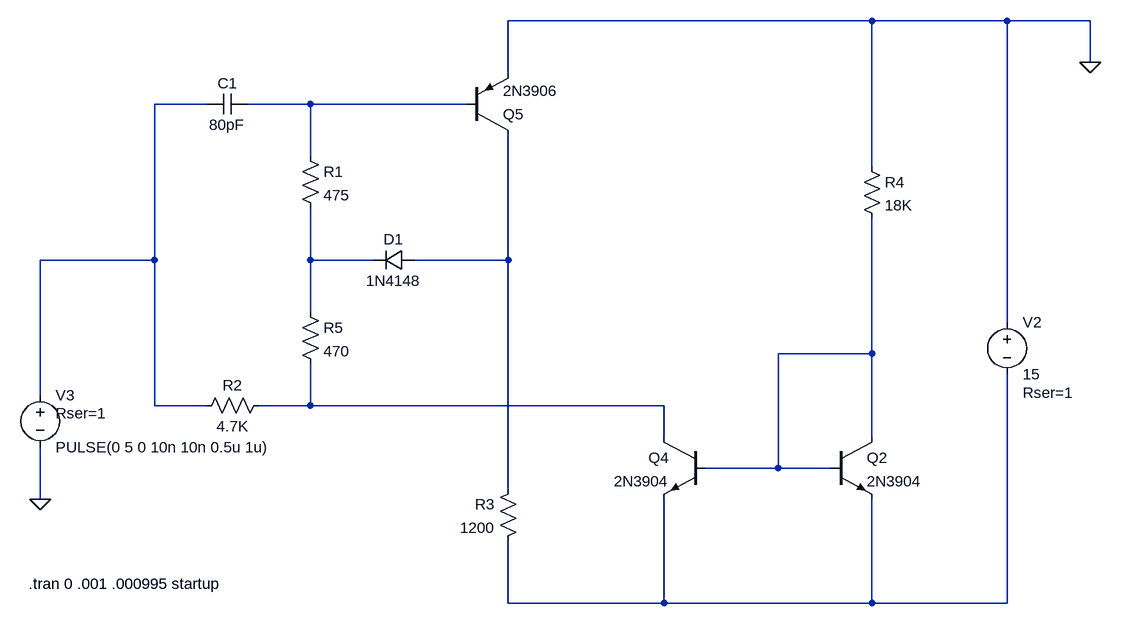
[diagram p0: schematic logicShift2.asc]
logicShift2.asc, the LTspice schematic file:
Version 4
SHEET 1 2612 788
WIRE 1968 -400 1408 -400
WIRE 2176 -400 1968 -400
WIRE 2304 -400 2176 -400
WIRE 2304 -336 2304 -400
WIRE 1408 -320 1408 -400
WIRE 944 -272 864 -272
WIRE 1104 -272 1008 -272
WIRE 1344 -272 1104 -272
WIRE 1104 -192 1104 -272
WIRE 1968 -176 1968 -400
WIRE 864 -32 864 -272
WIRE 864 -32 688 -32
WIRE 1104 -32 1104 -112
WIRE 1200 -32 1104 -32
WIRE 1408 -32 1408 -224
WIRE 1408 -32 1264 -32
WIRE 1104 48 1104 -32
WIRE 2176 64 2176 -400
WIRE 1968 112 1968 -96
WIRE 1968 112 1824 112
WIRE 688 176 688 -32
WIRE 864 192 864 -32
WIRE 944 192 864 192
WIRE 1104 192 1104 128
WIRE 1104 192 1024 192
WIRE 1648 192 1104 192
WIRE 1648 240 1648 192
WIRE 1968 240 1968 112
WIRE 1824 288 1824 112
WIRE 1824 288 1712 288
WIRE 1904 288 1824 288
WIRE 1408 320 1408 -32
WIRE 688 336 688 256
WIRE 1408 496 1408 400
WIRE 1648 496 1648 336
WIRE 1648 496 1408 496
WIRE 1968 496 1968 336
WIRE 1968 496 1648 496
WIRE 2176 496 2176 144
WIRE 2176 496 1968 496
FLAG 688 336 0
FLAG 2304 -336 0
SYMBOL res 1040 176 R90
WINDOW 0 0 56 VBottom 2
WINDOW 3 32 56 VTop 2
SYMATTR InstName R2
SYMATTR Value 4.7K
SYMBOL voltage 2176 48 R0
WINDOW 123 0 0 Left 2
WINDOW 39 24 124 Left 2
SYMATTR InstName V2
SYMATTR Value 15
SYMATTR SpiceLine Rser=1
SYMBOL voltage 688 160 R0
WINDOW 123 0 0 Left 2
WINDOW 39 24 44 Left 2
SYMATTR InstName V3
SYMATTR Value PULSE(0 5 0 10n 10n 0.5u 1u)
SYMATTR SpiceLine Rser=1
SYMBOL cap 944 -256 R270
WINDOW 0 32 32 VTop 2
WINDOW 3 0 32 VBottom 2
SYMATTR InstName C1
SYMATTR Value 80pF
SYMBOL npn 1712 240 M0
SYMATTR InstName Q4
SYMATTR Value 2N3904
SYMBOL pnp 1344 -224 M180
SYMATTR InstName Q5
SYMATTR Value 2N3906
SYMBOL res 1424 304 M0
SYMATTR InstName R3
SYMATTR Value 1200
SYMBOL npn 1904 240 R0
SYMATTR InstName Q2
SYMATTR Value 2N3904
SYMBOL res 1952 -192 R0
SYMATTR InstName R4
SYMATTR Value 18K
SYMBOL diode 1264 -48 R90
WINDOW 0 0 32 VBottom 2
WINDOW 3 32 32 VTop 2
SYMATTR InstName D1
SYMATTR Value 1N4148
SYMBOL res 1088 32 R0
SYMATTR InstName R5
SYMATTR Value 470
SYMBOL res 1088 -208 R0
SYMATTR InstName R1
SYMATTR Value 475
SYMATTR SpiceLine tol=1 pwr=0.1
TEXT 670 466 Left 2 !.tran 0 .001 .000995 startup

The netlist it stands for:
* logicShift2.asc
R2 N006 N001 4.7K
V2 0 N007 15 Rser=1
V3 N001 0 PULSE(0 5 0 10n 10n 0.5u 1u) Rser=1
C1 N001 N002 80pF
Q4 N006 N005 N007 0 2N3904
Q5 N004 N002 0 0 2N3906
R3 N004 N007 1200
Q2 N005 N005 N007 0 2N3904
R4 0 N005 18K
D1 N004 N003 1N4148
R5 N003 N006 470
R1 N002 N003 475 tol=1 pwr=0.1
.model D D
.lib standard.dio
.model NPN NPN
.model PNP PNP
.lib standard.bjt
.tran 0 .001 .000995 startup
.backanno
.end